# Altium schematic sheet Multivibrator.SchDoc
size A4
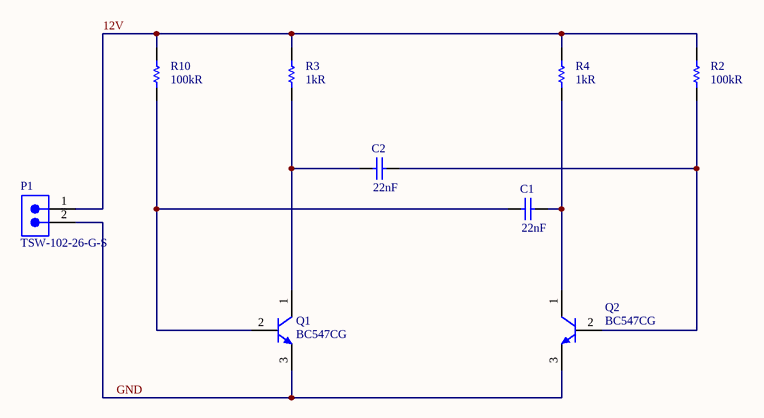
[diagram p0: Multivibrator.SchDoc]

## Parts
C1  Capacitance: 22nF  [CAPC1608X87X35ML15T15]  (hidden comment: C0603C223K4RACTU)
C2  Capacitance: 22nF  [CAPC1608X87X35ML15T15]  (hidden comment: C0603C223K4RACTU)
P1  TSW-102-26-G-S  [SMTC-TSW-102-26-XX-S]
Q1  BC547CG  [ONSC-TO-92-3-29-11]
Q2  BC547CG  [ONSC-TO-92-3-29-11]
R2  Resistance: 100kR  [RESC2013X70X40ML20T20]  (hidden comment: ERJ-6GEYJ104V)
R3  Resistance: 1kR  [RESC2013X50X30ML20T20]  (hidden comment: CRCW08051K00JNEA)
R4  Resistance: 1kR  [RESC2013X50X30ML20T20]  (hidden comment: CRCW08051K00JNEA)
R10  Resistance: 100kR  [RESC2013X70X40ML20T20]  (hidden comment: ERJ-6GEYJ104V)

## Nets
12V: P1.1 R2.2 R3.2 R4.2 R10.2
GND: P1.2 Q1.3(E) Q2.3(E)
NetC1_1: C1.1 Q1.2(B) R10.1
NetC1_2: C1.2 Q2.1(C) R4.1
NetC2_1: C2.1 Q1.1(C) R3.1
NetC2_2: C2.2 Q2.2(B) R2.1

## Library data of the parts
C1 C2 = CMP-2006-03139-1: Manufacturer: Kemet; Part Number: C0603C223K4RACTU
P1 = CMP-1024-00327-1: 0.025" SQ Post Header, Through-hole, Vertical, -55 to 125 degC, 2.54 mm Pitch, 2-Pin, Male, RoHS; Manufacturer: Samtec; Pitch: 2.54 mm; Orientation: Vertical; ComponentLink3Description: Package Specification; PackageReference: TSW-102-26-XX-S; Mounting Technology: Through-hole; ComponentLink2Description: Datasheet; ComponentLink1URL: http://www.samtec.com; DatasheetVersion: F-214; ComponentLink1Description: Manufacturer URL; RoHS: True; ComponentLink2URL: http://www.samtec.com/documents/webfiles/pdf/TSW_TH.PDF; PartNumber: TSW-102-26-G-S; ComponentLink3URL: http://www.samtec.com/documents/webfiles/cpdf/TSW-XXX-XX-XXX-X-XX-XXX-MKT.pdf; PackageDescription: .025[0.64] SQ. Post Terminal Strip Assembly; PackageVersion: DM, 8/1988; Temperature Range: -55 to 125 degC
Q1 Q2 = CMP-1048-01464-1: Amplifier Transistor, NPN Silicon, 3-Pin TO-92, Pb-Free, Bulk Box; Manufacturer: On Semiconductor; IC Continuous (A): 0.1; fT Min (MHz): 150; ComponentLink3URL: http://www.onsemi.cn/pub_link/Collateral/2N6426-D.PDF; Mounting Technology: Through Hole; PackageReference: TO-92-3-29-11_AM_SL; ComponentLink2Description: Datasheet; RoHS: TRUE; Packing: Bulk Box; ComponentLink1Description: Manufacturer URL; PackageDescription: 3-Pin Transistor Outline, Body 4.825 x 3.685 mm, Pitch 1.27 mm; PackageVersion: Rev. AM; ComponentLink2URL: http://www.onsemi.com/pub_link/Collateral/BC546-D.PDF; ComponentLink3Description: Package Specification; ComponentLink1URL: http://www.onsemi.com/; DatasheetVersion: Rev. 7; Polarity: NPN; PartNumber: BC547CG
R2 R10 = CMP-2001-00338-1: Manufacturer: Panasonic; Tolerance: 5%; Part Number: ERJ-6GEYJ104V; Case/Package: 0805
R3 R4 = CMP-2001-03597-1: Manufacturer: Vishay Dale; Tolerance: 5%; Part Number: CRCW08051K00JNEA; Case/Package: 0805